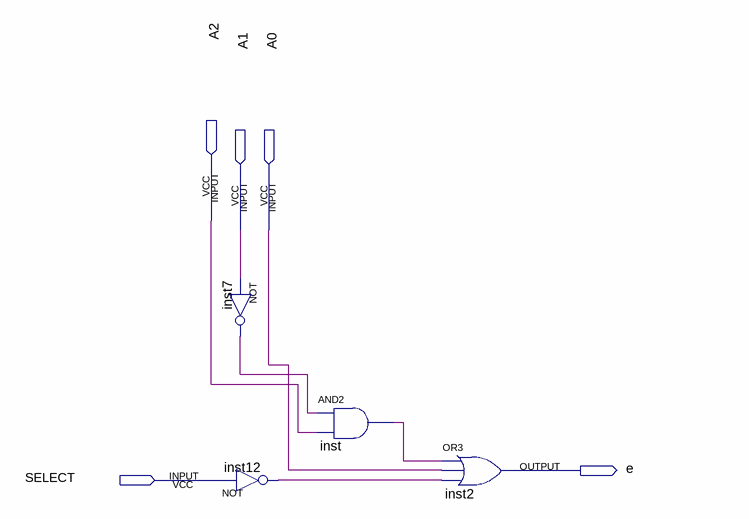
[diagram p0: schematic sheet]
// Quartus schematic segment_e.bdf as structural Verilog: 4 symbols, 5 pins
module segment_e (
  input  A2,
  input  A1,
  input  A0,
  input  SELECT,
  output e
);

  wire inst7_out, inst12_out, inst_out;

  not inst7 (inst7_out, A1);
  not inst12 (inst12_out, SELECT);
  and inst (inst_out, inst7_out, A2);
  or inst2 (e, inst_out, A0, inst12_out);
endmodule
